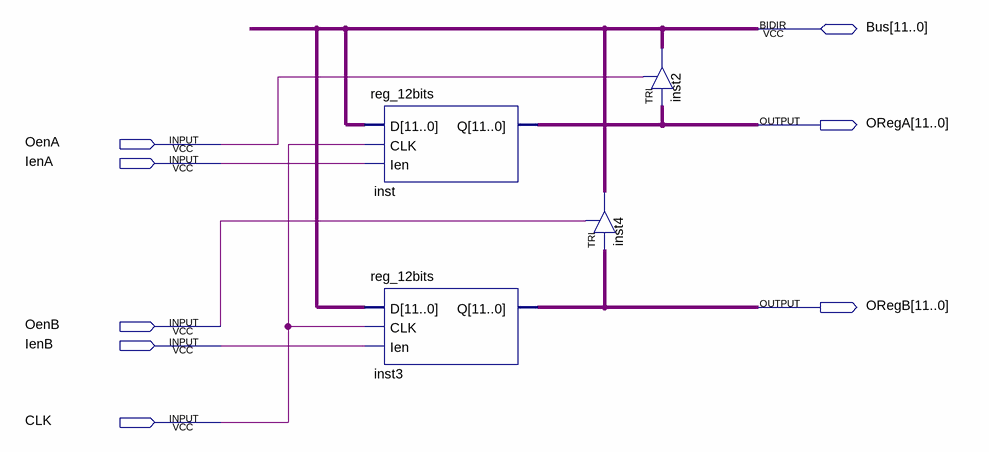
[diagram p0: schematic sheet]
// Quartus schematic almacenamiento.bdf as structural Verilog: 4 symbols, 8 pins
module almacenamiento (
  input  OenA,
  input  IenA,
  input  OenB,
  input  IenB,
  input  CLK,
  inout  [11:0] Bus,
  output [11:0] ORegA,
  output [11:0] ORegB
);

  reg_12bits inst (.D(Bus), .CLK(CLK), .Ien(IenA), .Q(ORegA));
  reg_12bits inst3 (.D(Bus), .CLK(CLK), .Ien(IenB), .Q(ORegB));
  TRI inst4[11:0] (.IN(ORegB), .OE(OenB), .OUT(Bus));
  TRI inst2[11:0] (.IN(ORegA), .OE(OenA), .OUT(Bus));
endmodule
